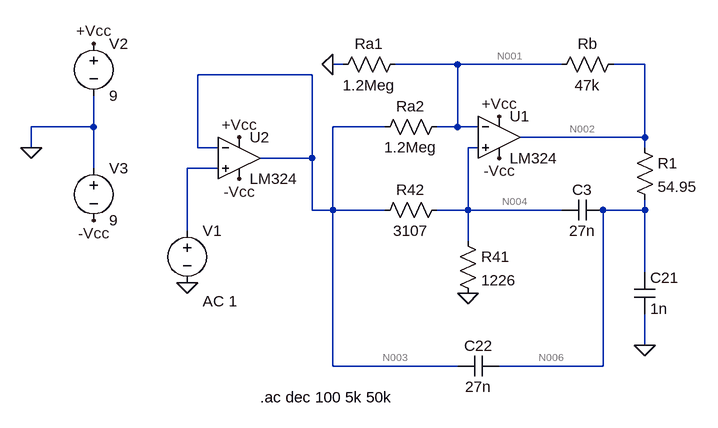
[diagram p0: schematic Sedra_etapa1.asc]
* Sedra_etapa1.asc
V1 N005 0 AC 1
R42 N004 N003 3107
Ra2 N001 N003 1.2Meg
* U1: LM324 (symbol sympropio\LM324 not available, pins judged from their places): In+=N004 In-=N001 V+=+Vcc V-=-Vcc OUT=N002
R41 N004 0 1226
C3 N006 N004 27n
C22 N006 N003 27n
Ra1 N001 0 1.2Meg
Rb N002 N001 47k
C21 N006 0 1n
V2 +Vcc 0 9
V3 0 -Vcc 9
* U2: LM324 (symbol sympropio\LM324 not available, pins judged from their places): In+=N005 In-=N003 V+=+Vcc V-=-Vcc OUT=N003
R1 N002 N006 54.95
.ac dec 100 5k 50k
.backanno
.end

* Results of the author's LTspice run, read from the files saved beside the schematic
* Operating Point, zero values left out:
*   V(n004) = 7.992 µV
*   V(n003) = -33.66 µV
*   V(n001) = -25.65 µV
*   V(n002) = -963.5 µV
*   V(-vcc) = -9 V
*   V(+vcc) = 9 V
*   V(n006) = -963.5 µV
*   I(Rb) = -19.96 nA
*   I(Ra1) = -21.37 pA
*   I(R41) = 6.519 nA
*   I(Ra2) = 6.672 pA
*   I(R42) = 13.4 nA
*   I(V3) = -1.208 mA
*   I(V2) = -1.208 mA
*   I(V1) = 19.92 nA
*   Ix(u1:1) = -19.92 nA
*   Ix(u1:2) = -19.94 nA
*   Ix(u1:3) = 603.9 µA
*   Ix(u1:4) = -603.8 µA
*   Ix(u1:5) = 19.96 nA
*   Ix(u2:1) = -19.92 nA
*   Ix(u2:2) = -19.94 nA
*   Ix(u2:3) = 603.9 µA
*   Ix(u2:4) = -603.8 µA
*   Ix(u2:5) = 33.35 nA
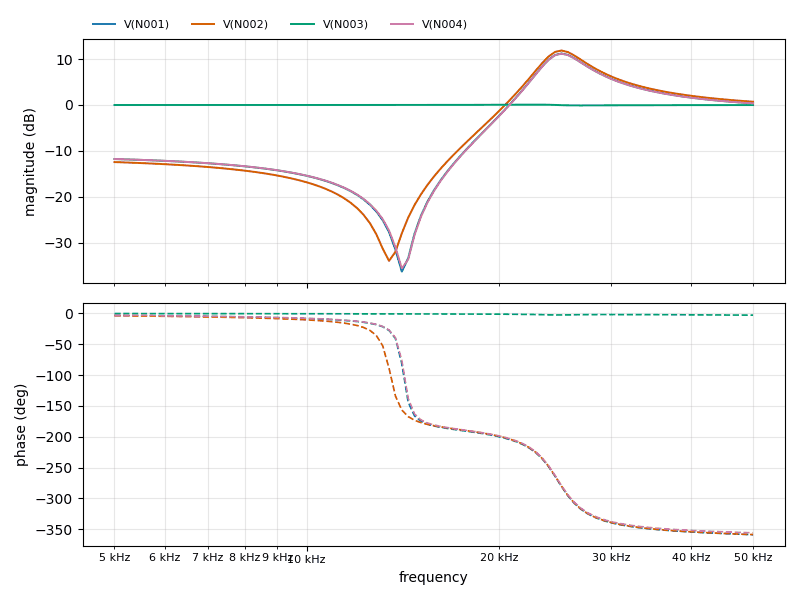
[diagram p1: AC Analysis of Sedra_etapa1.asc, plotted from the saved traces]
* AC Analysis, 1 run:
*   V(N001): -11.76 dB at 5 kHz, 0.37 dB at 50 kHz, peak 11.22 dB at 25.06 kHz, 3 dB below the peak at 23.31 kHz and 27.65 kHz
*   V(N002): -12.42 dB at 5 kHz, 0.72 dB at 50 kHz, peak 11.86 dB at 25.06 kHz, 3 dB below the peak at 23.29 kHz and 27.59 kHz
*   V(N003): 0.00 dB at 5 kHz, -0.01 dB at 50 kHz, peak 0.08 dB at 22.85 kHz
*   V(N004): -11.76 dB at 5 kHz, 0.35 dB at 50 kHz, peak 11.17 dB at 25.06 kHz, 3 dB below the peak at 23.32 kHz and 27.66 kHz